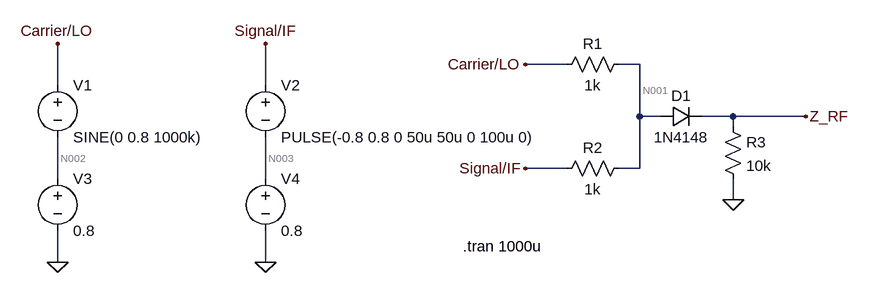
[diagram p0: schematic step1.asc]
step1.asc, the LTspice schematic file:
Version 4
SHEET 1 880 680
WIRE 128 64 64 64
WIRE 240 64 208 64
WIRE -656 96 -656 32
WIRE -336 96 -336 32
WIRE 240 144 240 64
WIRE 272 144 240 144
WIRE 384 144 336 144
WIRE 496 144 384 144
WIRE 384 160 384 144
WIRE 128 224 64 224
WIRE 240 224 240 144
WIRE 240 224 208 224
WIRE -656 240 -656 176
WIRE -336 240 -336 176
WIRE 384 272 384 240
WIRE -656 368 -656 320
WIRE -336 368 -336 320
FLAG 384 272 0
FLAG 496 144 Z_RF
FLAG 64 64 Carrier/LO
FLAG 64 224 Signal/IF
FLAG -656 32 Carrier/LO
FLAG -336 32 Signal/IF
FLAG -656 368 0
FLAG -336 368 0
SYMBOL res 224 48 R90
WINDOW 0 0 56 VBottom 2
WINDOW 3 32 56 VTop 2
SYMATTR InstName R1
SYMATTR Value 1k
SYMBOL res 224 208 R90
WINDOW 0 0 56 VBottom 2
WINDOW 3 32 56 VTop 2
SYMATTR InstName R2
SYMATTR Value 1k
SYMBOL diode 272 160 R270
WINDOW 0 32 32 VTop 2
WINDOW 3 0 32 VBottom 2
SYMATTR InstName D1
SYMATTR Value 1N4148
SYMBOL res 368 144 R0
SYMATTR InstName R3
SYMATTR Value 10k
SYMBOL voltage -656 80 R0
WINDOW 123 0 0 Left 0
WINDOW 39 0 0 Left 0
SYMATTR InstName V1
SYMATTR Value SINE(0 0.8 1000k)
SYMBOL voltage -336 80 R0
WINDOW 123 0 0 Left 0
WINDOW 39 0 0 Left 0
SYMATTR InstName V2
SYMATTR Value PULSE(-0.8 0.8 0 50u 50u 0 100u 0)
SYMBOL voltage -656 224 R0
WINDOW 123 0 0 Left 0
WINDOW 39 0 0 Left 0
SYMATTR InstName V3
SYMATTR Value 0.8
SYMBOL voltage -336 224 R0
WINDOW 123 0 0 Left 0
WINDOW 39 0 0 Left 0
SYMATTR InstName V4
SYMATTR Value 0.8
TEXT -32 344 Left 2 !.tran 1000u

The netlist it stands for:
* step1.asc
R1 N001 Carrier/LO 1k
R2 N001 Signal/IF 1k
D1 N001 Z_RF 1N4148
R3 Z_RF 0 10k
V1 Carrier/LO N002 SINE(0 0.8 1000k)
V2 Signal/IF N003 PULSE(-0.8 0.8 0 50u 50u 0 100u 0)
V3 N002 0 0.8
V4 N003 0 0.8
.model D D
.lib standard.dio
.tran 1000u
.backanno
.end

* Results of the author's LTspice run, read from the files saved beside the schematic
* Operating Point, zero values left out:
*   V(n001) = 397.4 mV
*   V(carrier/lo) = 800 mV
*   V(z_rf) = 51.75 mV
*   V(n002) = 800 mV
*   V(n003) = 800 mV
*   I(D1) = 5.175 µA
*   I(R1) = -402.6 µA
*   I(R2) = 397.4 µA
*   I(R3) = 5.175 µA
*   I(V1) = -402.6 µA
*   I(V2) = 397.4 µA
*   I(V3) = -402.6 µA
*   I(V4) = 397.4 µA
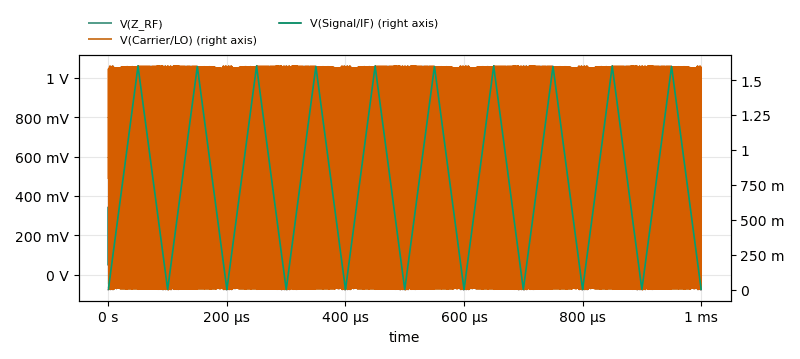
[diagram p1: Transient Analysis of step1.asc, plotted from the saved traces]
* Transient Analysis, 1 run:
*   V(Z_RF): min -74.4 mV, max 1.059 V, average 379.5 mV, rms 472.7 mV, last 110.2 mV
*   V(Carrier/LO): min 16.47 µ, max 1.6 , average 799.9 m, rms 984.5 m, last 800 m
*   V(Signal/IF): min 0, max 1.6 , average 800 m, rms 923.8 m, last 0